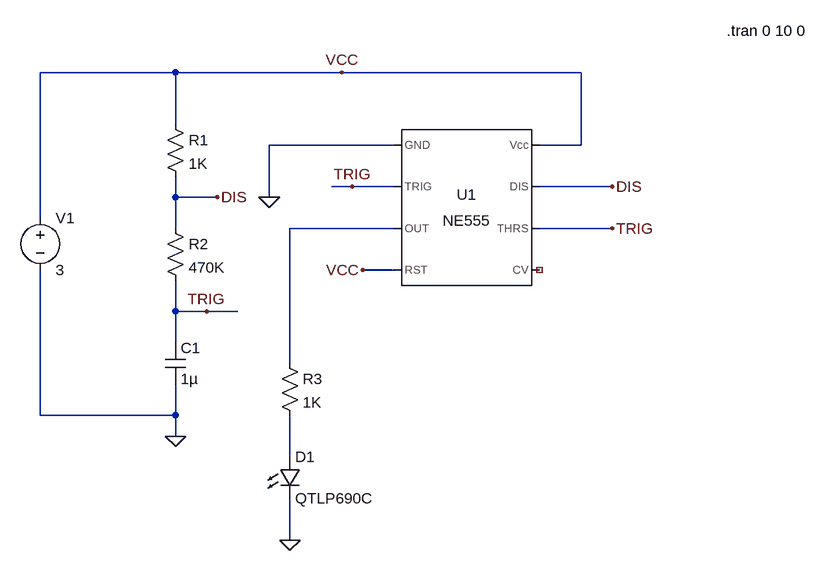
[diagram p0: schematic 555SpiceSimulation.asc]
555SpiceSimulation.asc, the LTspice schematic file:
Version 4
SHEET 1 1112 800
WIRE 128 48 -80 48
WIRE 384 48 128 48
WIRE 752 48 384 48
WIRE 128 128 128 48
WIRE 464 160 272 160
WIRE 752 160 752 48
WIRE 752 160 688 160
WIRE 400 224 368 224
WIRE 464 224 400 224
WIRE 800 224 688 224
WIRE 128 240 128 208
WIRE 192 240 128 240
WIRE 272 240 272 160
WIRE -80 272 -80 48
WIRE 128 288 128 240
WIRE 464 288 304 288
WIRE 800 288 688 288
WIRE 464 352 416 352
WIRE 128 416 128 368
WIRE 176 416 128 416
WIRE 224 416 176 416
WIRE 128 464 128 416
WIRE 304 496 304 288
WIRE -80 576 -80 352
WIRE 128 576 128 528
WIRE 128 576 -80 576
WIRE 128 608 128 576
WIRE 304 640 304 576
WIRE 304 768 304 704
FLAG 128 608 0
FLAG 304 768 0
FLAG 272 240 0
FLAG 384 48 VCC
FLAG 416 352 VCC
FLAG 400 224 TRIG
FLAG 176 416 TRIG
FLAG 800 224 DIS
FLAG 192 240 DIS
FLAG 800 288 TRIG
SYMBOL Misc/NE555 576 256 R0
SYMATTR InstName U1
SYMBOL res 112 112 R0
SYMATTR InstName R1
SYMATTR Value 1K
SYMBOL res 112 272 R0
SYMATTR InstName R2
SYMATTR Value 470K
SYMBOL cap 112 464 R0
SYMATTR InstName C1
SYMATTR Value 1µ
SYMBOL res 288 480 R0
SYMATTR InstName R3
SYMATTR Value 1K
SYMBOL LED 288 640 R0
SYMATTR InstName D1
SYMATTR Value QTLP690C
SYMBOL voltage -80 256 R0
SYMATTR InstName V1
SYMATTR Value 3
TEXT 976 -16 Left 2 !.tran 0 10 0

The netlist it stands for:
* 555SpiceSimulation.asc
XU1 0 TRIG N001 VCC NC_01 TRIG DIS VCC NE555  ; pins GND TRIG OUT RST CV THRS DIS Vcc
R1 VCC DIS 1K
R2 DIS TRIG 470K
C1 TRIG 0 1µ
R3 N001 N002 1K
D1 N002 0 QTLP690C
V1 VCC 0 3
.model D D
.lib standard.dio
.tran 0 10 0
.lib NE555.sub
.backanno
.end